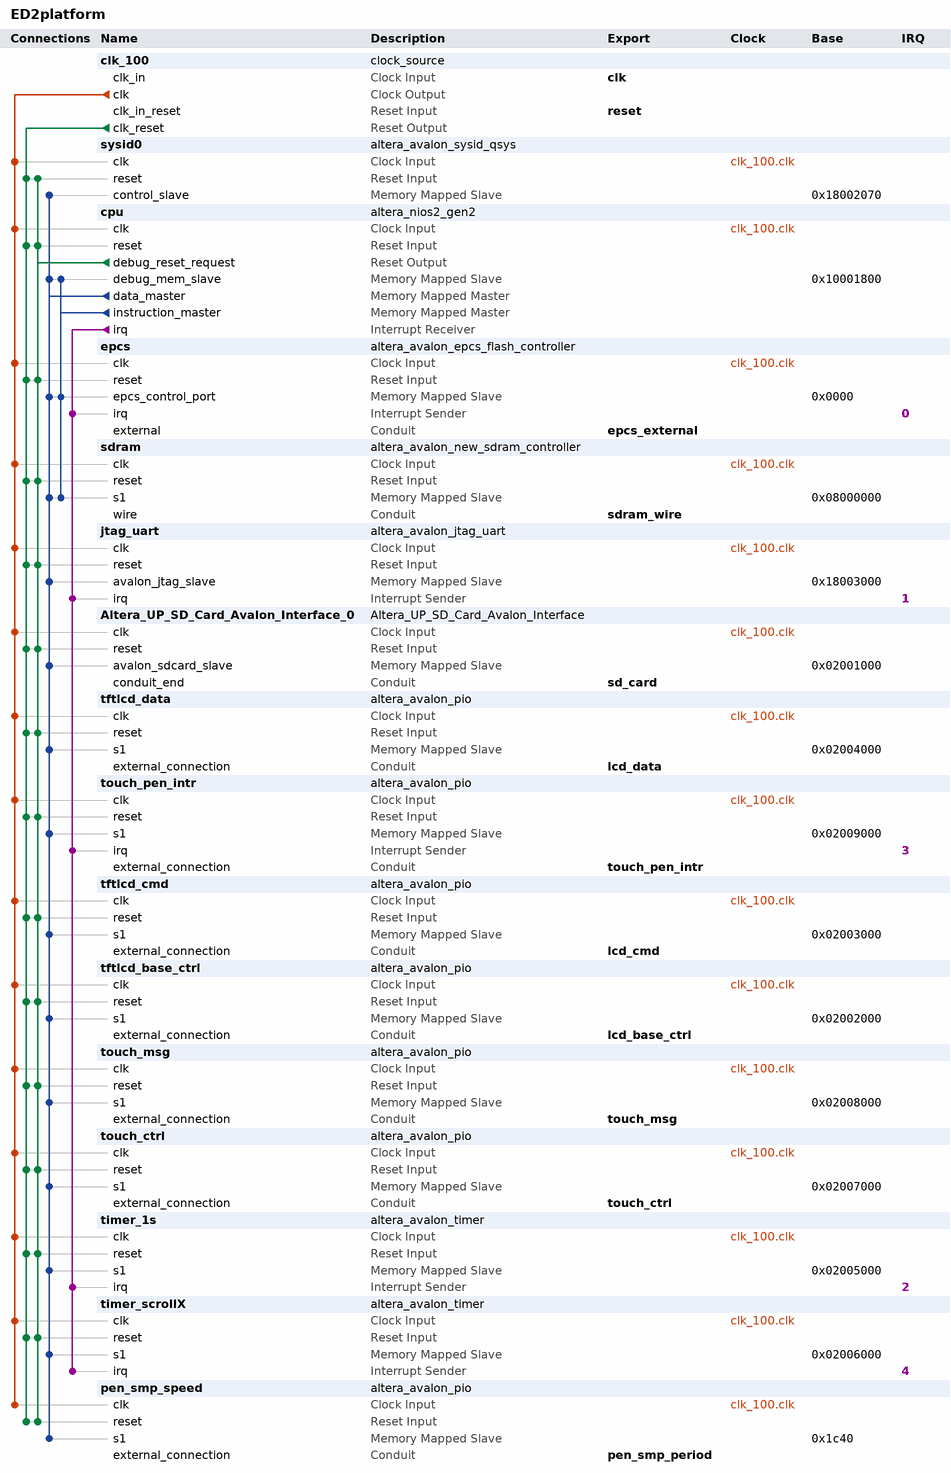
[diagram p0: system contents]
# Platform Designer (Qsys) system ED2platform, Cyclone IV E EP4CE115F29C7
# Parameters at their usual value, and those the tool derives, are not listed.
package require -exact qsys 15.0
create_system ED2platform
set_project_property DEVICE_FAMILY {Cyclone IV E}
set_project_property DEVICE EP4CE115F29C7

add_instance clk_100 clock_source 15.0
set_instance_parameter_value clk_100 clockFrequency 100000000

add_instance sysid0 altera_avalon_sysid_qsys 15.0
set_instance_parameter_value sysid0 id 305419896

add_instance cpu altera_nios2_gen2 15.0
set_instance_parameter_value cpu dcache_size 2048
set_instance_parameter_value cpu exceptionSlave sdram.s1
set_instance_parameter_value cpu icache_size 4096
set_instance_parameter_value cpu impl Fast
set_instance_parameter_value cpu resetSlave epcs.epcs_control_port

add_instance epcs altera_avalon_epcs_flash_controller 15.0
set_instance_parameter_value epcs resetrequest_enabled true

add_instance sdram altera_avalon_new_sdram_controller 15.0
set_instance_parameter_value sdram TAC 5.5
set_instance_parameter_value sdram TRCD 20.0
set_instance_parameter_value sdram TRP 20.0
set_instance_parameter_value sdram casLatency 3
set_instance_parameter_value sdram columnWidth 10
set_instance_parameter_value sdram dataWidth 32
set_instance_parameter_value sdram generateSimulationModel true
set_instance_parameter_value sdram model single_Micron_MT48LC4M32B2_7_chip
set_instance_parameter_value sdram numberOfBanks 4
set_instance_parameter_value sdram numberOfChipSelects 1
set_instance_parameter_value sdram powerUpDelay 100.0
set_instance_parameter_value sdram refreshPeriod 15.625
set_instance_parameter_value sdram rowWidth 13

add_instance jtag_uart altera_avalon_jtag_uart 15.0
set_instance_parameter_value jtag_uart simInteractiveOptions NO_INTERACTIVE_WINDOWS

add_instance Altera_UP_SD_Card_Avalon_Interface_0 Altera_UP_SD_Card_Avalon_Interface 15.0

add_instance tftlcd_data altera_avalon_pio 15.0
set_instance_parameter_value tftlcd_data direction Bidir
set_instance_parameter_value tftlcd_data width 16

add_instance touch_pen_intr altera_avalon_pio 15.0
set_instance_parameter_value touch_pen_intr captureEdge true
set_instance_parameter_value touch_pen_intr direction Input
set_instance_parameter_value touch_pen_intr edgeType FALLING
set_instance_parameter_value touch_pen_intr generateIRQ true
set_instance_parameter_value touch_pen_intr irqType EDGE
set_instance_parameter_value touch_pen_intr width 1

add_instance tftlcd_cmd altera_avalon_pio 15.0
set_instance_parameter_value tftlcd_cmd direction Output
set_instance_parameter_value tftlcd_cmd width 3

add_instance tftlcd_base_ctrl altera_avalon_pio 15.0
set_instance_parameter_value tftlcd_base_ctrl direction Output
set_instance_parameter_value tftlcd_base_ctrl width 3

add_instance touch_msg altera_avalon_pio 15.0
set_instance_parameter_value touch_msg direction Input
set_instance_parameter_value touch_msg width 2

add_instance touch_ctrl altera_avalon_pio 15.0
set_instance_parameter_value touch_ctrl direction Output
set_instance_parameter_value touch_ctrl width 3

add_instance timer_1s altera_avalon_timer 15.0
set_instance_parameter_value timer_1s fixedPeriod true
set_instance_parameter_value timer_1s period 1
set_instance_parameter_value timer_1s periodUnits SEC

add_instance timer_scrollX altera_avalon_timer 15.0
set_instance_parameter_value timer_scrollX period 1
set_instance_parameter_value timer_scrollX periodUnits MSEC

add_instance pen_smp_speed altera_avalon_pio 15.0
set_instance_parameter_value pen_smp_speed direction Output
set_instance_parameter_value pen_smp_speed resetValue 1
set_instance_parameter_value pen_smp_speed width 16

# connections
add_connection clk_100.clk Altera_UP_SD_Card_Avalon_Interface_0.clk clock
add_connection clk_100.clk cpu.clk clock
add_connection clk_100.clk epcs.clk clock
add_connection clk_100.clk jtag_uart.clk clock
add_connection clk_100.clk pen_smp_speed.clk clock
add_connection clk_100.clk sdram.clk clock
add_connection clk_100.clk sysid0.clk clock
add_connection clk_100.clk tftlcd_base_ctrl.clk clock
add_connection clk_100.clk tftlcd_cmd.clk clock
add_connection clk_100.clk tftlcd_data.clk clock
add_connection clk_100.clk timer_1s.clk clock
add_connection clk_100.clk timer_scrollX.clk clock
add_connection clk_100.clk touch_ctrl.clk clock
add_connection clk_100.clk touch_msg.clk clock
add_connection clk_100.clk touch_pen_intr.clk clock
add_connection clk_100.clk_reset Altera_UP_SD_Card_Avalon_Interface_0.reset reset
add_connection clk_100.clk_reset cpu.reset reset
add_connection clk_100.clk_reset epcs.reset reset
add_connection clk_100.clk_reset jtag_uart.reset reset
add_connection clk_100.clk_reset pen_smp_speed.reset reset
add_connection clk_100.clk_reset sdram.reset reset
add_connection clk_100.clk_reset sysid0.reset reset
add_connection clk_100.clk_reset tftlcd_base_ctrl.reset reset
add_connection clk_100.clk_reset tftlcd_cmd.reset reset
add_connection clk_100.clk_reset tftlcd_data.reset reset
add_connection clk_100.clk_reset timer_1s.reset reset
add_connection clk_100.clk_reset timer_scrollX.reset reset
add_connection clk_100.clk_reset touch_ctrl.reset reset
add_connection clk_100.clk_reset touch_msg.reset reset
add_connection clk_100.clk_reset touch_pen_intr.reset reset
add_connection cpu.debug_reset_request Altera_UP_SD_Card_Avalon_Interface_0.reset reset
add_connection cpu.debug_reset_request cpu.reset reset
add_connection cpu.debug_reset_request epcs.reset reset
add_connection cpu.debug_reset_request jtag_uart.reset reset
add_connection cpu.debug_reset_request pen_smp_speed.reset reset
add_connection cpu.debug_reset_request sdram.reset reset
add_connection cpu.debug_reset_request sysid0.reset reset
add_connection cpu.debug_reset_request tftlcd_base_ctrl.reset reset
add_connection cpu.debug_reset_request tftlcd_cmd.reset reset
add_connection cpu.debug_reset_request tftlcd_data.reset reset
add_connection cpu.debug_reset_request timer_1s.reset reset
add_connection cpu.debug_reset_request timer_scrollX.reset reset
add_connection cpu.debug_reset_request touch_ctrl.reset reset
add_connection cpu.debug_reset_request touch_msg.reset reset
add_connection cpu.debug_reset_request touch_pen_intr.reset reset
add_connection cpu.data_master Altera_UP_SD_Card_Avalon_Interface_0.avalon_sdcard_slave avalon
set_connection_parameter_value cpu.data_master/Altera_UP_SD_Card_Avalon_Interface_0.avalon_sdcard_slave baseAddress 0x02001000
add_connection cpu.data_master cpu.debug_mem_slave avalon
set_connection_parameter_value cpu.data_master/cpu.debug_mem_slave baseAddress 0x10001800
add_connection cpu.data_master epcs.epcs_control_port avalon
set_connection_parameter_value cpu.data_master/epcs.epcs_control_port baseAddress 0x0000
add_connection cpu.data_master jtag_uart.avalon_jtag_slave avalon
set_connection_parameter_value cpu.data_master/jtag_uart.avalon_jtag_slave baseAddress 0x18003000
add_connection cpu.data_master pen_smp_speed.s1 avalon
set_connection_parameter_value cpu.data_master/pen_smp_speed.s1 baseAddress 0x1c40
add_connection cpu.data_master sdram.s1 avalon
set_connection_parameter_value cpu.data_master/sdram.s1 baseAddress 0x08000000
add_connection cpu.data_master sysid0.control_slave avalon
set_connection_parameter_value cpu.data_master/sysid0.control_slave baseAddress 0x18002070
add_connection cpu.data_master tftlcd_base_ctrl.s1 avalon
set_connection_parameter_value cpu.data_master/tftlcd_base_ctrl.s1 baseAddress 0x02002000
add_connection cpu.data_master tftlcd_cmd.s1 avalon
set_connection_parameter_value cpu.data_master/tftlcd_cmd.s1 baseAddress 0x02003000
add_connection cpu.data_master tftlcd_data.s1 avalon
set_connection_parameter_value cpu.data_master/tftlcd_data.s1 baseAddress 0x02004000
add_connection cpu.data_master timer_1s.s1 avalon
set_connection_parameter_value cpu.data_master/timer_1s.s1 baseAddress 0x02005000
add_connection cpu.data_master timer_scrollX.s1 avalon
set_connection_parameter_value cpu.data_master/timer_scrollX.s1 baseAddress 0x02006000
add_connection cpu.data_master touch_ctrl.s1 avalon
set_connection_parameter_value cpu.data_master/touch_ctrl.s1 baseAddress 0x02007000
add_connection cpu.data_master touch_msg.s1 avalon
set_connection_parameter_value cpu.data_master/touch_msg.s1 baseAddress 0x02008000
add_connection cpu.data_master touch_pen_intr.s1 avalon
set_connection_parameter_value cpu.data_master/touch_pen_intr.s1 baseAddress 0x02009000
add_connection cpu.instruction_master cpu.debug_mem_slave avalon
set_connection_parameter_value cpu.instruction_master/cpu.debug_mem_slave baseAddress 0x10001800
add_connection cpu.instruction_master epcs.epcs_control_port avalon
set_connection_parameter_value cpu.instruction_master/epcs.epcs_control_port baseAddress 0x0000
add_connection cpu.instruction_master sdram.s1 avalon
set_connection_parameter_value cpu.instruction_master/sdram.s1 baseAddress 0x08000000
add_connection cpu.irq epcs.irq interrupt
set_connection_parameter_value cpu.irq/epcs.irq irqNumber 0
add_connection cpu.irq jtag_uart.irq interrupt
set_connection_parameter_value cpu.irq/jtag_uart.irq irqNumber 1
add_connection cpu.irq timer_1s.irq interrupt
set_connection_parameter_value cpu.irq/timer_1s.irq irqNumber 2
add_connection cpu.irq timer_scrollX.irq interrupt
set_connection_parameter_value cpu.irq/timer_scrollX.irq irqNumber 4
add_connection cpu.irq touch_pen_intr.irq interrupt
set_connection_parameter_value cpu.irq/touch_pen_intr.irq irqNumber 3

# exported interfaces
add_interface clk clock sink
set_interface_property clk EXPORT_OF clk_100.clk_in
add_interface epcs_external conduit end
set_interface_property epcs_external EXPORT_OF epcs.external
add_interface lcd_base_ctrl conduit end
set_interface_property lcd_base_ctrl EXPORT_OF tftlcd_base_ctrl.external_connection
add_interface lcd_cmd conduit end
set_interface_property lcd_cmd EXPORT_OF tftlcd_cmd.external_connection
add_interface lcd_data conduit end
set_interface_property lcd_data EXPORT_OF tftlcd_data.external_connection
add_interface pen_smp_period conduit end
set_interface_property pen_smp_period EXPORT_OF pen_smp_speed.external_connection
add_interface reset reset sink
set_interface_property reset EXPORT_OF clk_100.clk_in_reset
add_interface sd_card conduit end
set_interface_property sd_card EXPORT_OF Altera_UP_SD_Card_Avalon_Interface_0.conduit_end
add_interface sdram_wire conduit end
set_interface_property sdram_wire EXPORT_OF sdram.wire
add_interface touch_ctrl conduit end
set_interface_property touch_ctrl EXPORT_OF touch_ctrl.external_connection
add_interface touch_msg conduit end
set_interface_property touch_msg EXPORT_OF touch_msg.external_connection
add_interface touch_pen_intr conduit end
set_interface_property touch_pen_intr EXPORT_OF touch_pen_intr.external_connection

set_interconnect_requirement {$system} qsys_mm.clockCrossingAdapter HANDSHAKE
set_interconnect_requirement {$system} qsys_mm.enableEccProtection FALSE
set_interconnect_requirement {$system} qsys_mm.insertDefaultSlave FALSE
set_interconnect_requirement {$system} qsys_mm.maxAdditionalLatency 1

save_system ED2platform.qsys
